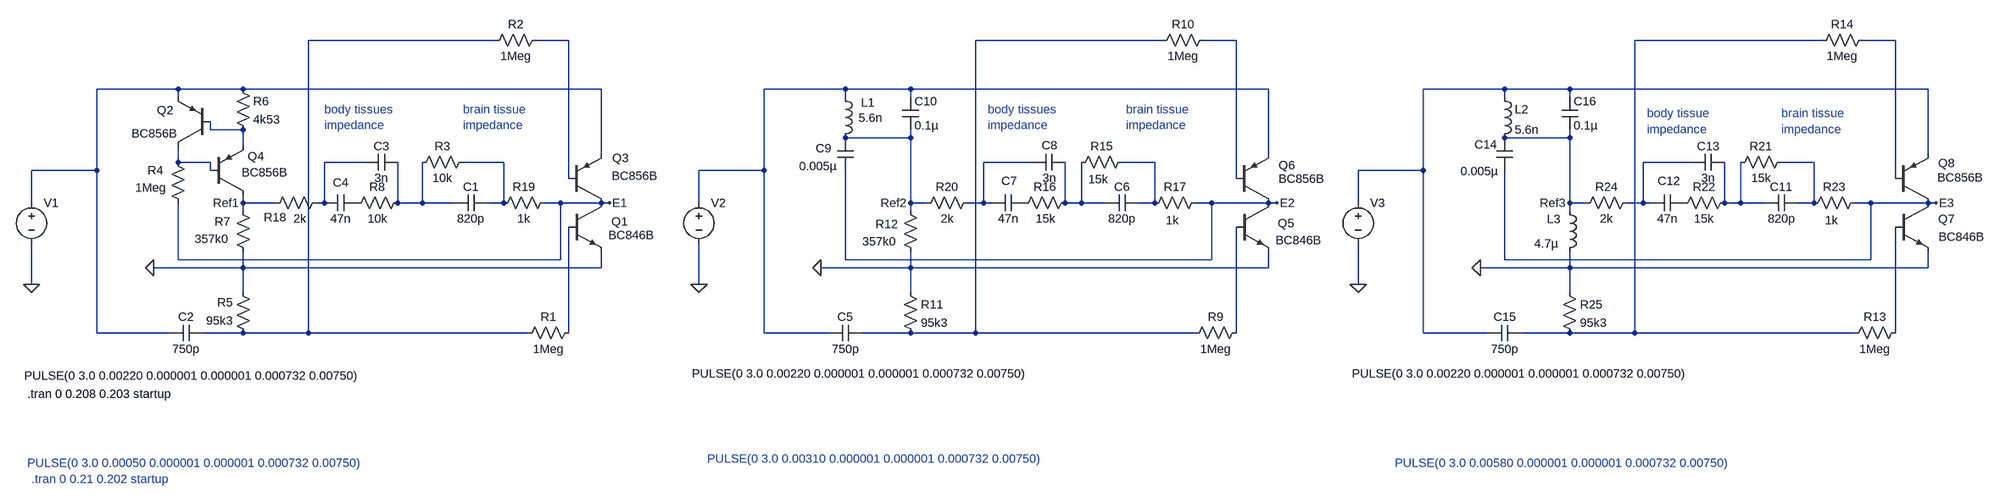
[diagram p0: schematic Method_Simulation_DCC-IPG_Bipolar_100µA_3source_3TransientOvershoot.asc]
Method_Simulation_DCC-IPG_Bipolar_100µA_3source_3TransientOvershoot.asc, the LTspice schematic file:
Version 4
SHEET 1 3028 1920
WIRE 16 560 -352 560
WIRE 160 560 96 560
WIRE 1328 560 960 560
WIRE 1472 560 1408 560
WIRE 2624 560 2256 560
WIRE 2768 560 2704 560
WIRE -608 656 -768 656
WIRE -480 656 -608 656
WIRE 224 656 -480 656
WIRE 704 656 544 656
WIRE 832 656 704 656
WIRE 1536 656 832 656
WIRE 2000 656 1840 656
WIRE 2128 656 2000 656
WIRE 2832 656 2128 656
WIRE -608 672 -608 656
WIRE 704 672 704 656
WIRE 832 672 832 656
WIRE 2000 672 2000 656
WIRE 2128 672 2128 656
WIRE -544 736 -544 720
WIRE -480 736 -544 736
WIRE 832 752 832 736
WIRE 832 752 704 752
WIRE 2128 752 2128 736
WIRE 2128 752 2000 752
WIRE -480 768 -480 736
WIRE 224 784 224 656
WIRE 1536 784 1536 656
WIRE 2832 784 2832 656
WIRE -608 800 -608 768
WIRE -544 800 -608 800
WIRE -240 800 -320 800
WIRE 32 800 -48 800
WIRE 1072 800 976 800
WIRE 1312 800 1248 800
WIRE 2368 800 2272 800
WIRE 2608 800 2544 800
WIRE -768 816 -768 656
WIRE -768 816 -896 816
WIRE -544 816 -544 800
WIRE 544 816 544 656
WIRE 544 816 416 816
WIRE 1840 816 1840 656
WIRE 1840 816 1712 816
WIRE 160 832 160 560
WIRE 1472 832 1472 560
WIRE 2768 832 2768 560
WIRE -896 880 -896 816
WIRE -480 880 -480 864
WIRE -416 880 -480 880
WIRE -320 880 -320 800
WIRE -320 880 -336 880
WIRE -176 880 -176 800
WIRE -128 880 -128 800
WIRE -128 880 -176 880
WIRE -64 880 -128 880
WIRE 32 880 32 800
WIRE 32 880 0 880
WIRE 144 880 112 880
WIRE 224 880 144 880
WIRE 240 880 224 880
WIRE 416 880 416 816
WIRE 832 880 832 752
WIRE 864 880 832 880
WIRE 976 880 976 800
WIRE 976 880 944 880
WIRE 992 880 976 880
WIRE 1136 880 1136 800
WIRE 1168 880 1168 800
WIRE 1168 880 1136 880
WIRE 1216 880 1168 880
WIRE 1312 880 1312 800
WIRE 1312 880 1280 880
WIRE 1424 880 1392 880
WIRE 1536 880 1424 880
WIRE 1552 880 1536 880
WIRE 1712 880 1712 816
WIRE 2128 880 2128 752
WIRE 2160 880 2128 880
WIRE 2272 880 2272 800
WIRE 2272 880 2240 880
WIRE 2288 880 2272 880
WIRE 2432 880 2432 800
WIRE 2464 880 2464 800
WIRE 2464 880 2432 880
WIRE 2512 880 2464 880
WIRE 2608 880 2608 800
WIRE 2608 880 2576 880
WIRE 2720 880 2688 880
WIRE 2832 880 2720 880
WIRE 2848 880 2832 880
WIRE -480 896 -480 880
WIRE 832 896 832 880
WIRE 2128 896 2128 880
WIRE -608 992 -608 880
WIRE 144 992 144 880
WIRE 144 992 -608 992
WIRE 704 992 704 816
WIRE 1424 992 1424 880
WIRE 1424 992 704 992
WIRE 2000 992 2000 816
WIRE 2720 992 2720 880
WIRE 2720 992 2000 992
WIRE -480 1008 -480 976
WIRE -480 1008 -656 1008
WIRE 224 1008 224 976
WIRE 224 1008 -480 1008
WIRE 832 1008 832 976
WIRE 832 1008 656 1008
WIRE 1536 1008 1536 976
WIRE 1536 1008 832 1008
WIRE 2128 1008 2128 976
WIRE 2128 1008 1952 1008
WIRE 2832 1008 2832 976
WIRE 2832 1008 2128 1008
WIRE -896 1040 -896 960
WIRE 416 1040 416 960
WIRE 1712 1040 1712 960
WIRE -480 1056 -480 1008
WIRE 832 1056 832 1008
WIRE 2128 1056 2128 1008
WIRE -768 1136 -768 816
WIRE -624 1136 -768 1136
WIRE -480 1136 -560 1136
WIRE -352 1136 -352 560
WIRE -352 1136 -480 1136
WIRE 80 1136 -352 1136
WIRE 160 1136 160 928
WIRE 544 1136 544 816
WIRE 672 1136 544 1136
WIRE 832 1136 736 1136
WIRE 960 1136 960 560
WIRE 960 1136 832 1136
WIRE 1392 1136 960 1136
WIRE 1472 1136 1472 928
WIRE 1840 1136 1840 816
WIRE 1968 1136 1840 1136
WIRE 2128 1136 2032 1136
WIRE 2256 1136 2256 560
WIRE 2256 1136 2128 1136
WIRE 2688 1136 2256 1136
WIRE 2768 1136 2768 928
FLAG -896 1040 0
FLAG 240 880 E1
FLAG -656 1008 0
FLAG 416 1040 0
FLAG 1552 880 E2
FLAG 656 1008 0
FLAG -480 880 Ref1
FLAG 832 880 Ref2
FLAG 1712 1040 0
FLAG 2848 880 E3
FLAG 1952 1008 0
FLAG 2128 880 Ref3
SYMBOL VOLTAGE -896 864 R0
WINDOW 123 0 0 Left 2
WINDOW 39 0 0 Left 2
WINDOW 3 -14 356 Left 2
SYMATTR Value PULSE(0 3.0 0.00220 0.000001 0.000001 0.000732 0.00750)
SYMATTR InstName V1
SYMBOL npn 160 880 R0
WINDOW 0 84 37 Left 2
WINDOW 3 78 64 Left 2
SYMATTR InstName Q1
SYMATTR Value BC846B
SYMBOL res 176 1120 R90
WINDOW 0 0 56 VBottom 2
WINDOW 3 32 56 VTop 2
SYMATTR InstName R1
SYMATTR Value 1Meg
SYMATTR SpiceLine tol=5 pwr=0.05
SYMBOL res 112 544 R90
WINDOW 0 0 56 VBottom 2
WINDOW 3 32 56 VTop 2
SYMATTR InstName R2
SYMATTR Value 1Meg
SYMATTR SpiceLine tol=5 pwr=0.05
SYMBOL cap -560 1120 R90
WINDOW 0 0 32 VBottom 2
WINDOW 3 32 32 VTop 2
SYMATTR InstName C2
SYMATTR Value 750p
SYMATTR SpiceLine V=10
SYMBOL res -464 1152 R180
WINDOW 0 36 76 Left 2
WINDOW 3 36 40 Left 2
SYMATTR InstName R5
SYMATTR Value 95k3
SYMATTR SpiceLine tol=1 pwr=0.05
SYMBOL pnp 160 880 M180
WINDOW 0 86 88 Left 2
WINDOW 3 85 53 Left 2
SYMATTR InstName Q3
SYMATTR Value BC856B
SYMBOL pnp -544 768 R180
WINDOW 0 73 70 Left 2
WINDOW 3 66 24 Left 2
SYMATTR InstName Q2
SYMATTR Value BC856B
SYMBOL pnp -544 864 M180
WINDOW 3 61 44 Left 2
WINDOW 0 73 75 Left 2
SYMATTR Value BC856B
SYMATTR InstName Q4
SYMBOL res -624 784 R0
WINDOW 0 -44 32 Left 2
WINDOW 3 -68 66 Left 2
SYMATTR InstName R4
SYMATTR Value 1Meg
SYMATTR SpiceLine tol=5 pwr=0.05
SYMBOL res -496 640 R0
SYMATTR InstName R6
SYMATTR Value 4k53
SYMATTR SpiceLine tol=1 pwr=0.05
SYMBOL res -496 880 R0
WINDOW 0 -40 37 Left 2
WINDOW 3 -79 71 Left 2
SYMATTR InstName R7
SYMATTR Value 357k0
SYMATTR SpiceLine tol=1 pwr=0.05
SYMBOL cap 0 864 R90
WINDOW 0 0 32 VBottom 2
WINDOW 3 32 32 VTop 2
SYMATTR InstName C1
SYMATTR Value 820p
SYMBOL res -32 784 R90
WINDOW 0 0 56 VBottom 2
WINDOW 3 32 56 VTop 2
SYMATTR InstName R3
SYMATTR Value 10k
SYMATTR SpiceLine tol=1 pwr=0.05
SYMBOL cap -256 864 R90
WINDOW 0 -8 32 VBottom 2
WINDOW 3 32 32 VTop 2
SYMATTR InstName C4
SYMATTR Value 47n
SYMBOL res -160 864 R90
WINDOW 0 0 56 VBottom 2
WINDOW 3 32 56 VTop 2
SYMATTR InstName R8
SYMATTR Value 10k
SYMBOL cap -176 784 R90
WINDOW 0 0 32 VBottom 2
WINDOW 3 32 32 VTop 2
SYMATTR InstName C3
SYMATTR Value 3n
SYMBOL npn 1472 880 R0
WINDOW 0 82 40 Left 2
WINDOW 3 78 74 Left 2
SYMATTR InstName Q5
SYMATTR Value BC846B
SYMBOL res 1488 1120 R90
WINDOW 0 0 56 VBottom 2
WINDOW 3 32 56 VTop 2
SYMATTR InstName R9
SYMATTR Value 1Meg
SYMATTR SpiceLine tol=5 pwr=0.05
SYMBOL res 1424 544 R90
WINDOW 0 0 56 VBottom 2
WINDOW 3 32 56 VTop 2
SYMATTR InstName R10
SYMATTR Value 1Meg
SYMATTR SpiceLine tol=5 pwr=0.05
SYMBOL pnp 1472 880 M180
WINDOW 0 84 74 Left 2
WINDOW 3 84 47 Left 2
SYMATTR InstName Q6
SYMATTR Value BC856B
SYMBOL cap 1280 864 R90
WINDOW 0 0 32 VBottom 2
WINDOW 3 32 32 VTop 2
SYMATTR InstName C6
SYMATTR Value 820p
SYMBOL res 1264 784 R90
WINDOW 0 0 56 VBottom 2
WINDOW 3 34 63 VTop 2
SYMATTR InstName R15
SYMATTR Value 15k
SYMATTR SpiceLine tol=1 pwr=0.05
SYMBOL cap 1056 864 R90
WINDOW 0 -11 30 VBottom 2
WINDOW 3 32 32 VTop 2
SYMATTR InstName C7
SYMATTR Value 47n
SYMBOL res 1152 864 R90
WINDOW 0 0 56 VBottom 2
WINDOW 3 32 54 VTop 2
SYMATTR InstName R16
SYMATTR Value 15k
SYMBOL cap 1136 784 R90
WINDOW 0 -1 31 VBottom 2
WINDOW 3 32 31 VTop 2
SYMATTR InstName C8
SYMATTR Value 3n
SYMBOL VOLTAGE 416 864 R0
WINDOW 123 0 0 Left 2
WINDOW 39 0 0 Left 2
WINDOW 3 -14 352 Left 2
SYMATTR Value PULSE(0 3.0 0.00220 0.000001 0.000001 0.000732 0.00750)
SYMATTR InstName V2
SYMBOL res 1408 864 R90
WINDOW 0 0 56 VBottom 2
WINDOW 3 35 61 VTop 2
SYMATTR InstName R17
SYMATTR Value 1k
SYMATTR SpiceLine tol=5
SYMBOL res -320 864 R90
WINDOW 0 60 97 VBottom 2
WINDOW 3 32 48 VTop 2
SYMATTR InstName R18
SYMATTR Value 2k
SYMATTR SpiceLine tol=5
SYMBOL res 128 864 R90
WINDOW 0 0 56 VBottom 2
WINDOW 3 32 56 VTop 2
SYMATTR InstName R19
SYMATTR Value 1k
SYMATTR SpiceLine tol=5
SYMBOL res 960 864 R90
WINDOW 0 0 56 VBottom 2
WINDOW 3 32 56 VTop 2
SYMATTR InstName R20
SYMATTR Value 2k
SYMATTR SpiceLine tol=5
SYMBOL ind 688 656 R0
WINDOW 0 47 27 Left 2
WINDOW 3 42 57 Left 2
SYMATTR InstName L1
SYMATTR Value 5.6n
SYMBOL res 816 1040 R0
SYMATTR InstName R11
SYMATTR Value 95k3
SYMBOL cap 688 752 R0
WINDOW 0 -42 21 Left 2
WINDOW 3 -75 56 Left 2
SYMATTR InstName C9
SYMATTR Value 0.005µ
SYMBOL cap 736 1120 R90
WINDOW 0 0 32 VBottom 2
WINDOW 3 32 32 VTop 2
SYMATTR InstName C5
SYMATTR Value 750p
SYMBOL cap 816 672 R0
SYMATTR InstName C10
SYMATTR Value 0.1µ
SYMBOL res 816 880 R0
WINDOW 0 -53 42 Left 2
WINDOW 3 -79 76 Left 2
SYMATTR InstName R12
SYMATTR Value 357k0
SYMBOL npn 2768 880 R0
WINDOW 0 84 32 Left 2
WINDOW 3 85 67 Left 2
SYMATTR InstName Q7
SYMATTR Value BC846B
SYMBOL res 2784 1120 R90
WINDOW 0 0 56 VBottom 2
WINDOW 3 32 56 VTop 2
SYMATTR InstName R13
SYMATTR Value 1Meg
SYMATTR SpiceLine tol=5 pwr=0.05
SYMBOL res 2720 544 R90
WINDOW 0 0 56 VBottom 2
WINDOW 3 32 56 VTop 2
SYMATTR InstName R14
SYMATTR Value 1Meg
SYMATTR SpiceLine tol=5 pwr=0.05
SYMBOL pnp 2768 880 M180
WINDOW 0 84 78 Left 2
WINDOW 3 83 50 Left 2
SYMATTR InstName Q8
SYMATTR Value BC856B
SYMBOL cap 2576 864 R90
WINDOW 0 0 32 VBottom 2
WINDOW 3 32 32 VTop 2
SYMATTR InstName C11
SYMATTR Value 820p
SYMBOL res 2560 784 R90
WINDOW 0 0 56 VBottom 2
WINDOW 3 32 56 VTop 2
SYMATTR InstName R21
SYMATTR Value 15k
SYMATTR SpiceLine tol=1 pwr=0.05
SYMBOL cap 2352 864 R90
WINDOW 0 -11 29 VBottom 2
WINDOW 3 32 32 VTop 2
SYMATTR InstName C12
SYMATTR Value 47n
SYMBOL res 2448 864 R90
WINDOW 0 0 56 VBottom 2
WINDOW 3 32 56 VTop 2
SYMATTR InstName R22
SYMATTR Value 15k
SYMBOL cap 2432 784 R90
WINDOW 0 0 32 VBottom 2
WINDOW 3 32 32 VTop 2
SYMATTR InstName C13
SYMATTR Value 3n
SYMBOL res 2704 864 R90
WINDOW 0 0 56 VBottom 2
WINDOW 3 35 61 VTop 2
SYMATTR InstName R23
SYMATTR Value 1k
SYMATTR SpiceLine tol=5
SYMBOL res 2256 864 R90
WINDOW 0 0 56 VBottom 2
WINDOW 3 32 56 VTop 2
SYMATTR InstName R24
SYMATTR Value 2k
SYMATTR SpiceLine tol=5
SYMBOL ind 1984 656 R0
SYMATTR InstName L2
SYMATTR Value 5.6n
SYMBOL res 2112 1040 R0
SYMATTR InstName R25
SYMATTR Value 95k3
SYMBOL cap 1984 752 R0
WINDOW 0 -43 13 Left 2
WINDOW 3 -71 66 Left 2
SYMATTR InstName C14
SYMATTR Value 0.005µ
SYMBOL cap 2032 1120 R90
WINDOW 0 0 32 VBottom 2
WINDOW 3 32 32 VTop 2
SYMATTR InstName C15
SYMATTR Value 750p
SYMBOL cap 2112 672 R0
SYMATTR InstName C16
SYMATTR Value 0.1µ
SYMBOL VOLTAGE 1712 864 R0
WINDOW 123 0 0 Left 2
WINDOW 39 0 0 Left 2
WINDOW 3 -12 352 Left 2
SYMATTR Value PULSE(0 3.0 0.00220 0.000001 0.000001 0.000732 0.00750)
SYMATTR InstName V3
SYMBOL ind 2112 880 R0
WINDOW 0 -29 32 Left 2
WINDOW 3 -54 80 Left 2
SYMATTR InstName L3
SYMATTR Value 4.7µ
TEXT -896 1792 Left 2 ;.tran 0 0.21 0.202 startup
TEXT -48 696 Left 2 ;brain tissue\nimpedance
TEXT -320 696 Left 2 ;body tissues\nimpedance
TEXT 984 696 Left 2 ;body tissues\nimpedance
TEXT 1256 696 Left 2 ;brain tissue \nimpedance
TEXT 2280 704 Left 2 ;body tissue\nimpedance
TEXT 2544 704 Left 2 ;brain tissue \nimpedance
TEXT -904 1256 Left 2 !.tran 0 0.208 0.203 startup
TEXT -904 1760 Left 2 ;PULSE(0 3.0 0.00050 0.000001 0.000001 0.000732 0.00750)
TEXT 432 1752 Left 2 ;PULSE(0 3.0 0.00310 0.000001 0.000001 0.000732 0.00750)
TEXT 1784 1760 Left 2 ;PULSE(0 3.0 0.00580 0.000001 0.000001 0.000732 0.00750)

The netlist it stands for:
* Method_Simulation_DCC-IPG_Bipolar_100µA_3source_3TransientOvershoot.asc
V1 N007 0 PULSE(0 3.0 0.00220 0.000001 0.000001 0.000732 0.00750)
Q1 E1 N021 0 0 BC846B
R1 N021 N001 1Meg tol=5 pwr=0.05
R2 N002 N001 1Meg tol=5 pwr=0.05
C2 N001 N007 750p V=10
R5 N001 0 95k3 tol=1 pwr=0.05
Q3 E1 N002 N007 0 BC856B
Q2 N011 N010 N007 0 BC856B
Q4 Ref1 N011 N010 0 BC856B
R4 N011 E1 1Meg tol=5 pwr=0.05
R6 N007 N010 4k53 tol=1 pwr=0.05
R7 Ref1 0 357k0 tol=1 pwr=0.05
C1 N013 N018 820p
R3 N013 N018 10k tol=1 pwr=0.05
C4 P001 N012 47n
R8 N018 P001 10k
C3 N018 N012 3n
Q5 E2 N022 0 0 BC846B
R9 N022 N003 1Meg tol=5 pwr=0.05
R10 N004 N003 1Meg tol=5 pwr=0.05
Q6 E2 N004 N008 0 BC856B
C6 N015 N019 820p
R15 N015 N019 15k tol=1 pwr=0.05
C7 P002 N014 47n
R16 N019 P002 15k
C8 N019 N014 3n
V2 N008 0 PULSE(0 3.0 0.00220 0.000001 0.000001 0.000732 0.00750)
R17 E2 N015 1k tol=5
R18 N012 Ref1 2k tol=5
R19 E1 N013 1k tol=5
R20 N014 Ref2 2k tol=5
L1 N008 Ref2 5.6n
R11 0 N003 95k3
C9 Ref2 E2 0.005µ
C5 N003 N008 750p
C10 N008 Ref2 0.1µ
R12 Ref2 0 357k0
Q7 E3 N023 0 0 BC846B
R13 N023 N005 1Meg tol=5 pwr=0.05
R14 N006 N005 1Meg tol=5 pwr=0.05
Q8 E3 N006 N009 0 BC856B
C11 N017 N020 820p
R21 N017 N020 15k tol=1 pwr=0.05
C12 P003 N016 47n
R22 N020 P003 15k
C13 N020 N016 3n
R23 E3 N017 1k tol=5
R24 N016 Ref3 2k tol=5
L2 N009 Ref3 5.6n
R25 0 N005 95k3
C14 Ref3 E3 0.005µ
C15 N005 N009 750p
C16 N009 Ref3 0.1µ
V3 N009 0 PULSE(0 3.0 0.00220 0.000001 0.000001 0.000732 0.00750)
L3 Ref3 0 4.7µ
.model NPN NPN
.model PNP PNP
.lib standard.bjt
* .tran 0 0.21 0.202 startup
* brain tissue
* impedance
* body tissues
* impedance
* body tissues
* impedance
* brain tissue
* impedance
* body tissue
* impedance
* brain tissue
* impedance
.tran 0 0.208 0.203 startup
* PULSE(0 3.0 0.00050 0.000001 0.000001 0.000732 0.00750)
* PULSE(0 3.0 0.00310 0.000001 0.000001 0.000732 0.00750)
* PULSE(0 3.0 0.00580 0.000001 0.000001 0.000732 0.00750)
.backanno
.end